# Altium schematic sheet D_OUTPUT.SchDoc
size A; SheetNumber: 2; SheetTotal: 5
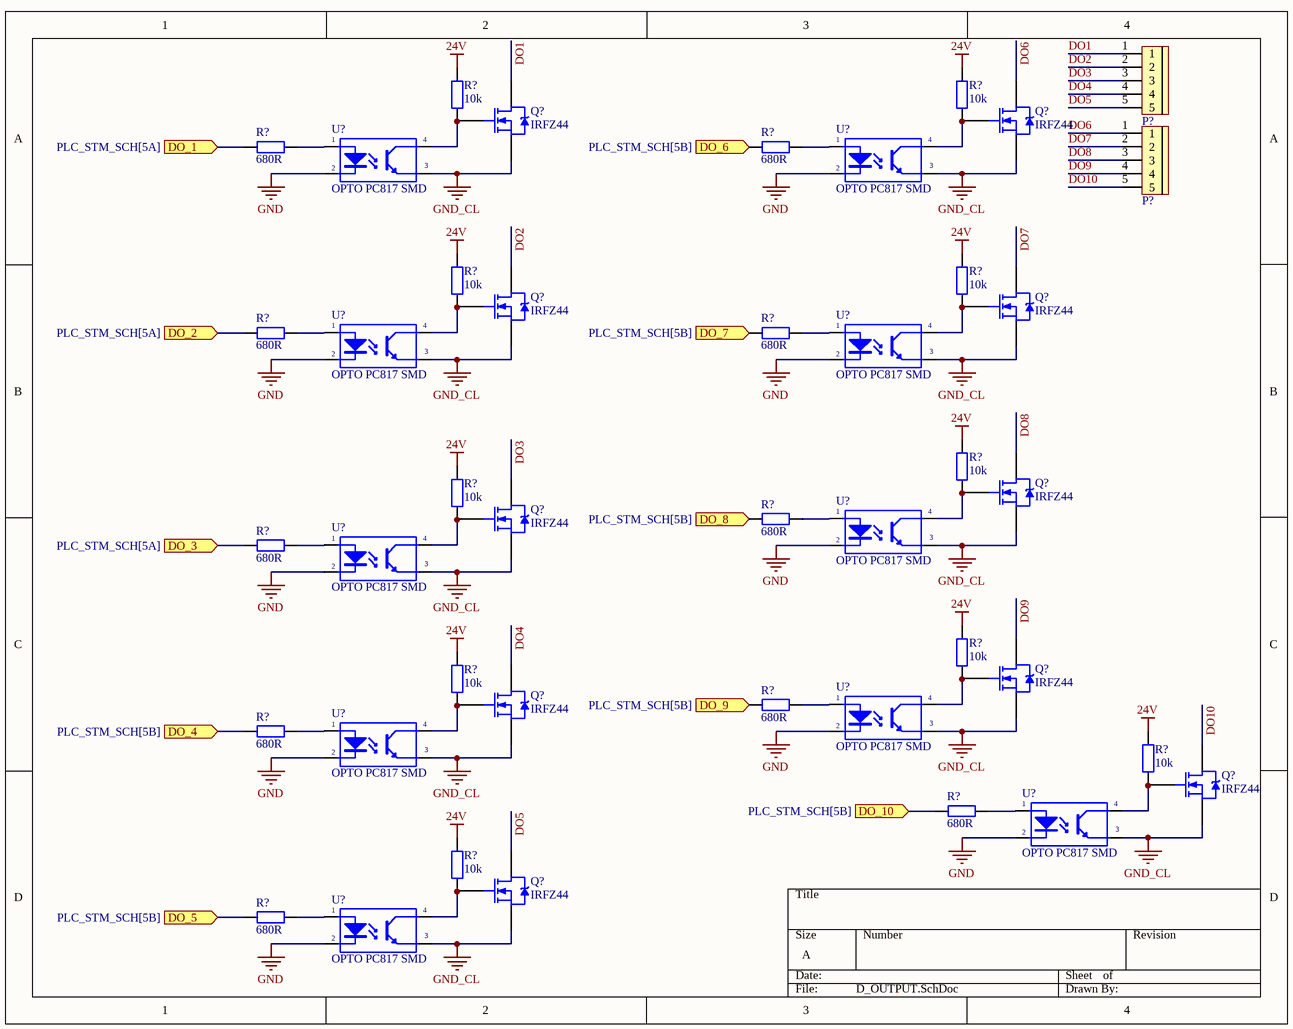
[diagram p0: D_OUTPUT.SchDoc]

## Parts
(Parts that share a designator on the sheet are numbered #1, #2 ... from top to bottom, then left to right.)
P?#1  CON 5 EDG5.08  [CON 5 5EDG5.08]  (value not drawn)
P?#2  CON 5 EDG5.08  [CON 5 5EDG5.08]  (value not drawn)
Q?#1  IRFZ44  [TO220]
Q?#2  IRFZ44  [TO220]
Q?#3  IRFZ44  [TO220]
Q?#4  IRFZ44  [TO220]
Q?#5  IRFZ44  [TO220]
Q?#6  IRFZ44  [TO220]
Q?#7  IRFZ44  [TO220]
Q?#8  IRFZ44  [TO220]
Q?#9  IRFZ44  [TO220]
Q?#10  IRFZ44  [TO220]
R?#1  10k  [tro smd 0805]
R?#2  10k  [tro smd 0805]
R?#3  680R  [Tro SMD 0805]
R?#4  680R  [Tro SMD 0805]
R?#5  10k  [tro smd 0805]
R?#6  10k  [tro smd 0805]
R?#7  680R  [Tro SMD 0805]
R?#8  680R  [Tro SMD 0805]
R?#9  10k  [tro smd 0805]
R?#10  10k  [tro smd 0805]
R?#11  680R  [Tro SMD 0805]
R?#12  680R  [Tro SMD 0805]
R?#13  10k  [tro smd 0805]
R?#14  10k  [tro smd 0805]
R?#15  680R  [Tro SMD 0805]
R?#16  680R  [Tro SMD 0805]
R?#17  10k  [tro smd 0805]
R?#18  680R  [Tro SMD 0805]
R?#19  10k  [tro smd 0805]
R?#20  680R  [Tro SMD 0805]
U?#1  OPTO PC817 SMD  [SOP4]
U?#2  OPTO PC817 SMD  [SOP4]
U?#3  OPTO PC817 SMD  [SOP4]
U?#4  OPTO PC817 SMD  [SOP4]
U?#5  OPTO PC817 SMD  [SOP4]
U?#6  OPTO PC817 SMD  [SOP4]
U?#7  OPTO PC817 SMD  [SOP4]
U?#8  OPTO PC817 SMD  [SOP4]
U?#9  OPTO PC817 SMD  [SOP4]
U?#10  OPTO PC817 SMD  [SOP4]

## Ports
DO_1 (in, see PLC_STM_SCH[5A]), DO_2 (in, see PLC_STM_SCH[5A]), DO_3 (in, see PLC_STM_SCH[5A]), DO_4 (in, see PLC_STM_SCH[5B]), DO_5 (in, see PLC_STM_SCH[5B]), DO_6 (in, see PLC_STM_SCH[5B]), DO_7 (in, see PLC_STM_SCH[5B]), DO_8 (in, see PLC_STM_SCH[5B]), DO_9 (in, see PLC_STM_SCH[5B]), DO_10 (in, see PLC_STM_SCH[5B])

## Nets
24V: R?#1.2 R?#2.2 R?#5.2 R?#6.2 R?#9.2 R?#10.2 R?#13.2 R?#14.2 R?#17.2 R?#19.2
GND: U?#1.2(K) U?#2.2(K) U?#3.2(K) U?#4.2(K) U?#5.2(K) U?#6.2(K) U?#7.2(K) U?#8.2(K) U?#9.2(K) U?#10.2(K)
GND_CL: Q?#1.3(S) Q?#2.3(S) Q?#3.3(S) Q?#4.3(S) Q?#5.3(S) Q?#6.3(S) Q?#7.3(S) Q?#8.3(S) Q?#9.3(S) Q?#10.3(S) U?#1.3(E) U?#2.3(E) U?#3.3(E) U?#4.3(E) U?#5.3(E) U?#6.3(E) U?#7.3(E) U?#8.3(E) U?#9.3(E) U?#10.3(E)
DO1: P?#1.1 Q?#1.2(D)
DO2: P?#1.2 Q?#3.2(D)
DO3: P?#1.3 Q?#6.2(D)
DO4: P?#1.4 Q?#8.2(D)
DO5: P?#1.5 Q?#10.2(D)
DO6: P?#2.1 Q?#2.2(D)
DO7: P?#2.2 Q?#4.2(D)
DO8: P?#2.3 Q?#5.2(D)
DO9: P?#2.4 Q?#7.2(D)
DO10: P?#2.5 Q?#9.2(D)
DO_1: R?#3.1 ; port DO_1
DO_2: R?#7.1 ; port DO_2
DO_3: R?#12.1 ; port DO_3
DO_4: R?#16.1 ; port DO_4
DO_5: R?#20.1 ; port DO_5
DO_6: R?#4.1 ; port DO_6
DO_7: R?#8.1 ; port DO_7
DO_8: R?#11.1 ; port DO_8
DO_9: R?#15.1 ; port DO_9
DO_10: R?#18.1 ; port DO_10
NetQ?#1_1: Q?#1.1(G) R?#1.1 U?#1.4(C)
NetQ?#2_1: Q?#2.1(G) R?#2.1 U?#2.4(C)
NetQ?#3_1: Q?#3.1(G) R?#5.1 U?#3.4(C)
NetQ?#4_1: Q?#4.1(G) R?#6.1 U?#4.4(C)
NetQ?#5_1: Q?#5.1(G) R?#9.1 U?#5.4(C)
NetQ?#6_1: Q?#6.1(G) R?#10.1 U?#6.4(C)
NetQ?#7_1: Q?#7.1(G) R?#13.1 U?#7.4(C)
NetQ?#8_1: Q?#8.1(G) R?#14.1 U?#8.4(C)
NetQ?#9_1: Q?#9.1(G) R?#17.1 U?#9.4(C)
NetQ?#10_1: Q?#10.1(G) R?#19.1 U?#10.4(C)
NetR?#3_2: R?#3.2 U?#1.1(A)
NetR?#4_2: R?#4.2 U?#2.1(A)
NetR?#7_2: R?#7.2 U?#3.1(A)
NetR?#8_2: R?#8.2 U?#4.1(A)
NetR?#11_2: R?#11.2 U?#5.1(A)
NetR?#12_2: R?#12.2 U?#6.1(A)
NetR?#15_2: R?#15.2 U?#7.1(A)
NetR?#16_2: R?#16.2 U?#8.1(A)
NetR?#18_2: R?#18.2 U?#9.1(A)
NetR?#20_2: R?#20.2 U?#10.1(A)

## Library data of the parts
P?#1 P?#2 = CON 5 EDG5.08: Cắm; Ten_Linh_Kien: CON 5 2EDG5.08-5P 5.08MM ( Xanh Cong); Ma_Hang: MH003589; Kieu_Chan: *; Don_Vi: Con; Ghi_Chu: *; Chung_Loai: Cắm
Q?#1-Q?#10 = IRFZ44 DIP: N-Channel Power MOSFET
R?#1 R?#2 R?#5 R?#6 R?#9 R?#10 R?#13 R?#14 R?#17 R?#19 = Tro 0805 5% 10k: Dán; Don_Vi: Con; So_Chan: 2; Ten_Linh_Kien: Trở 0805 5% 10k; Ma_Hang: MH005239; Chung_Loai: Dán; Kieu_Chan: *
R?#3 R?#4 R?#7 R?#8 R?#11 R?#12 R?#15 R?#16 R?#18 R?#20 = Tro 0805 5% 680R: Dán; Don_Vi: Con; Ma_Hang: MH005344; So_Chan: 2; Ten_Linh_Kien: Trở 0805 5% 680R; Chung_Loai: Dán; Kieu_Chan: *
U?#1-U?#10 = OPTO PC817 SMD: Single Opto; Value: PC817